# Altium schematic sheet hp_main.SchDoc
size A1
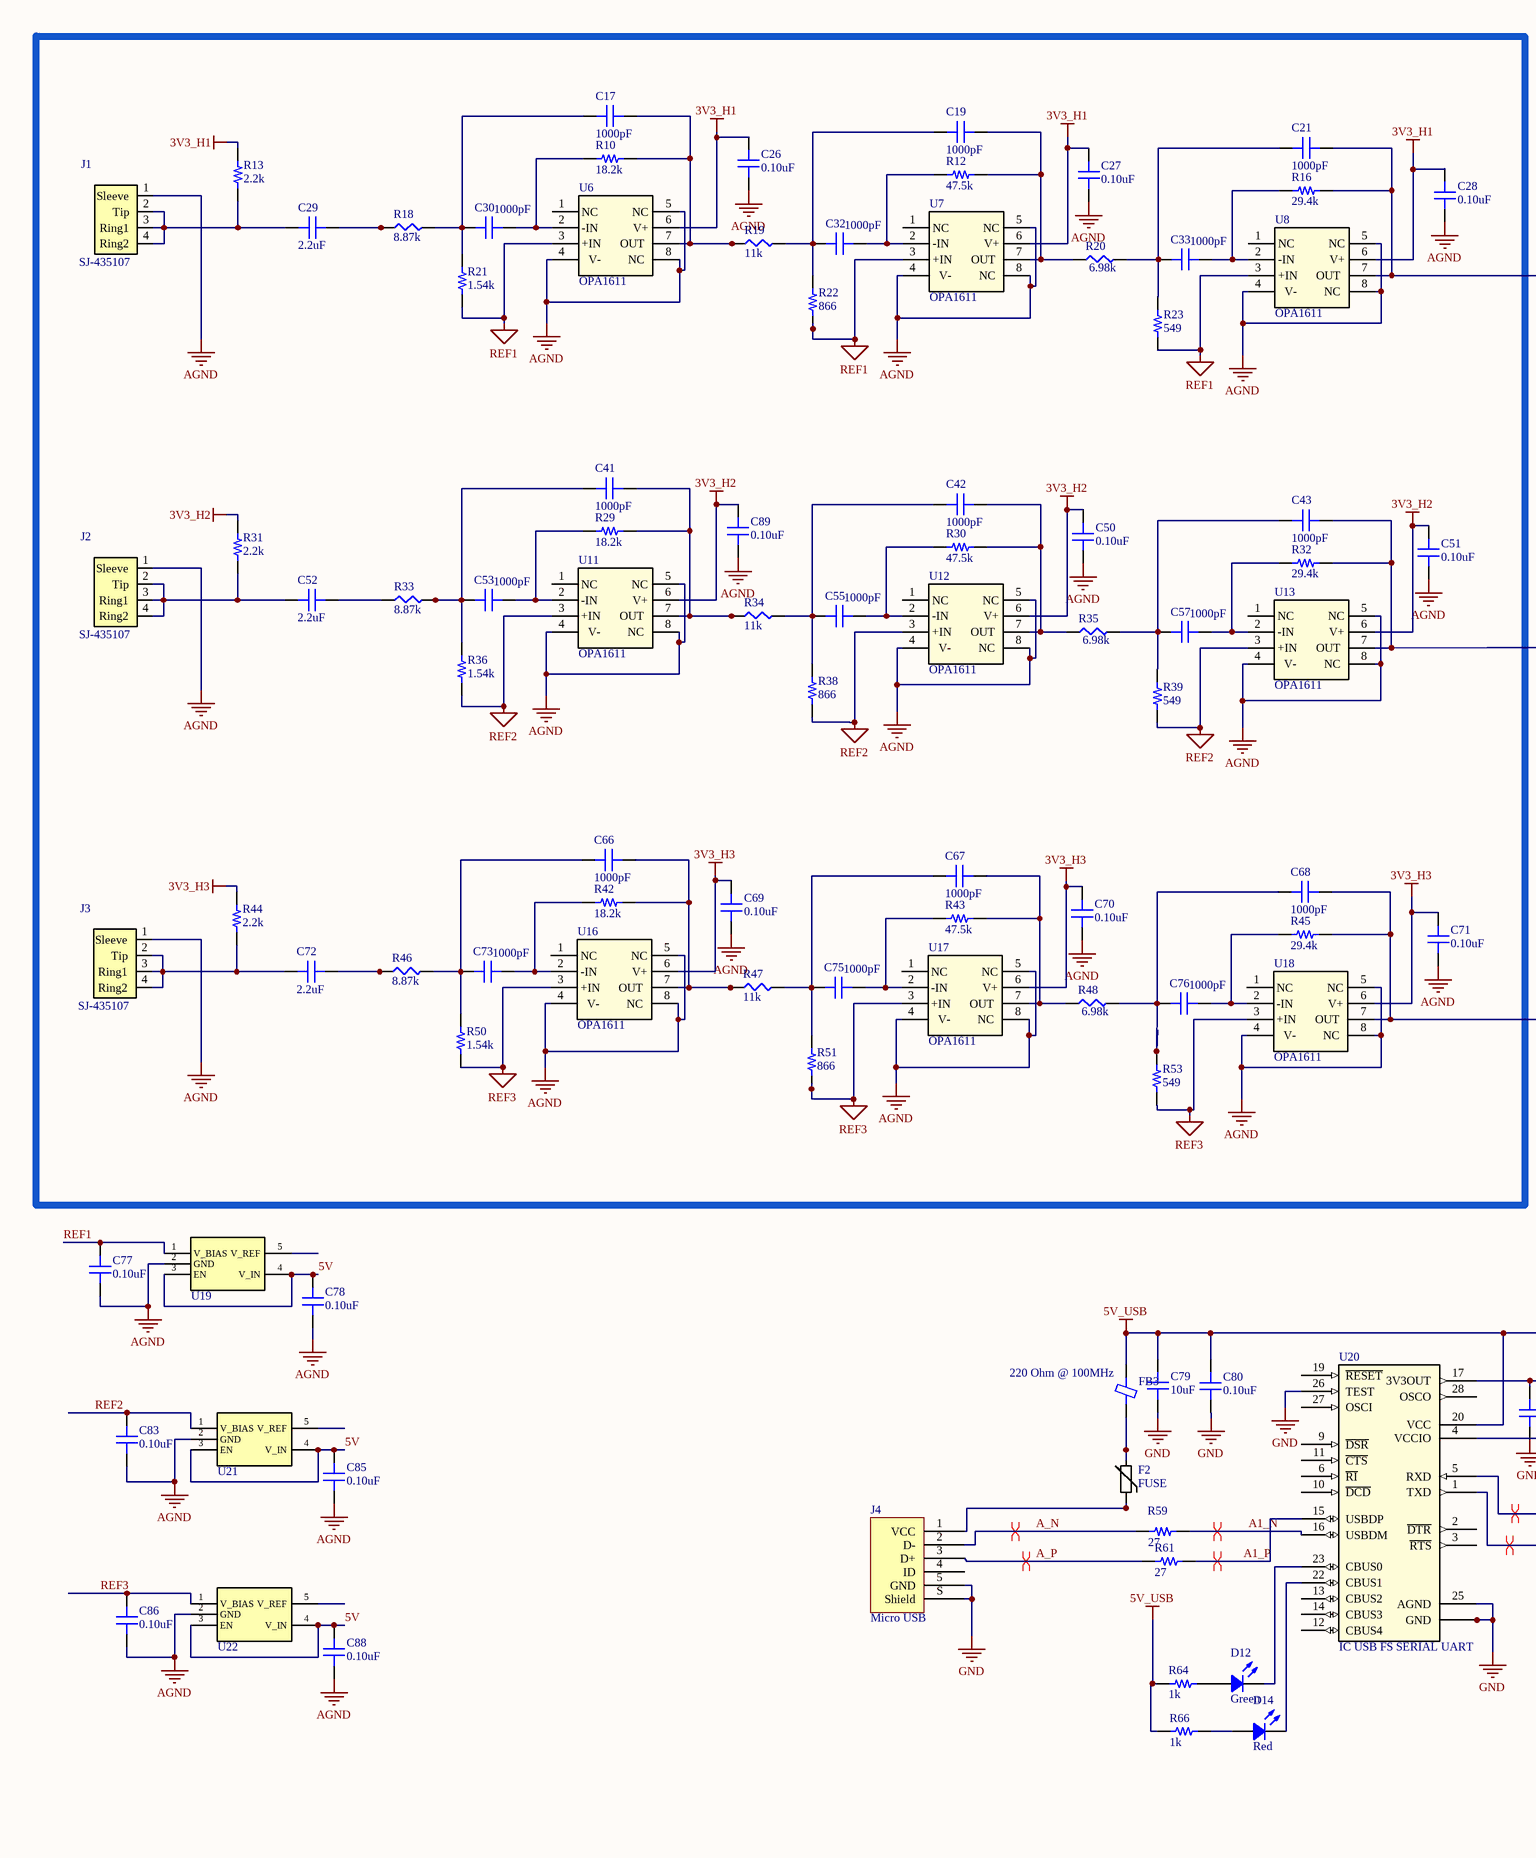
[diagram p0: hp_main.SchDoc, left]
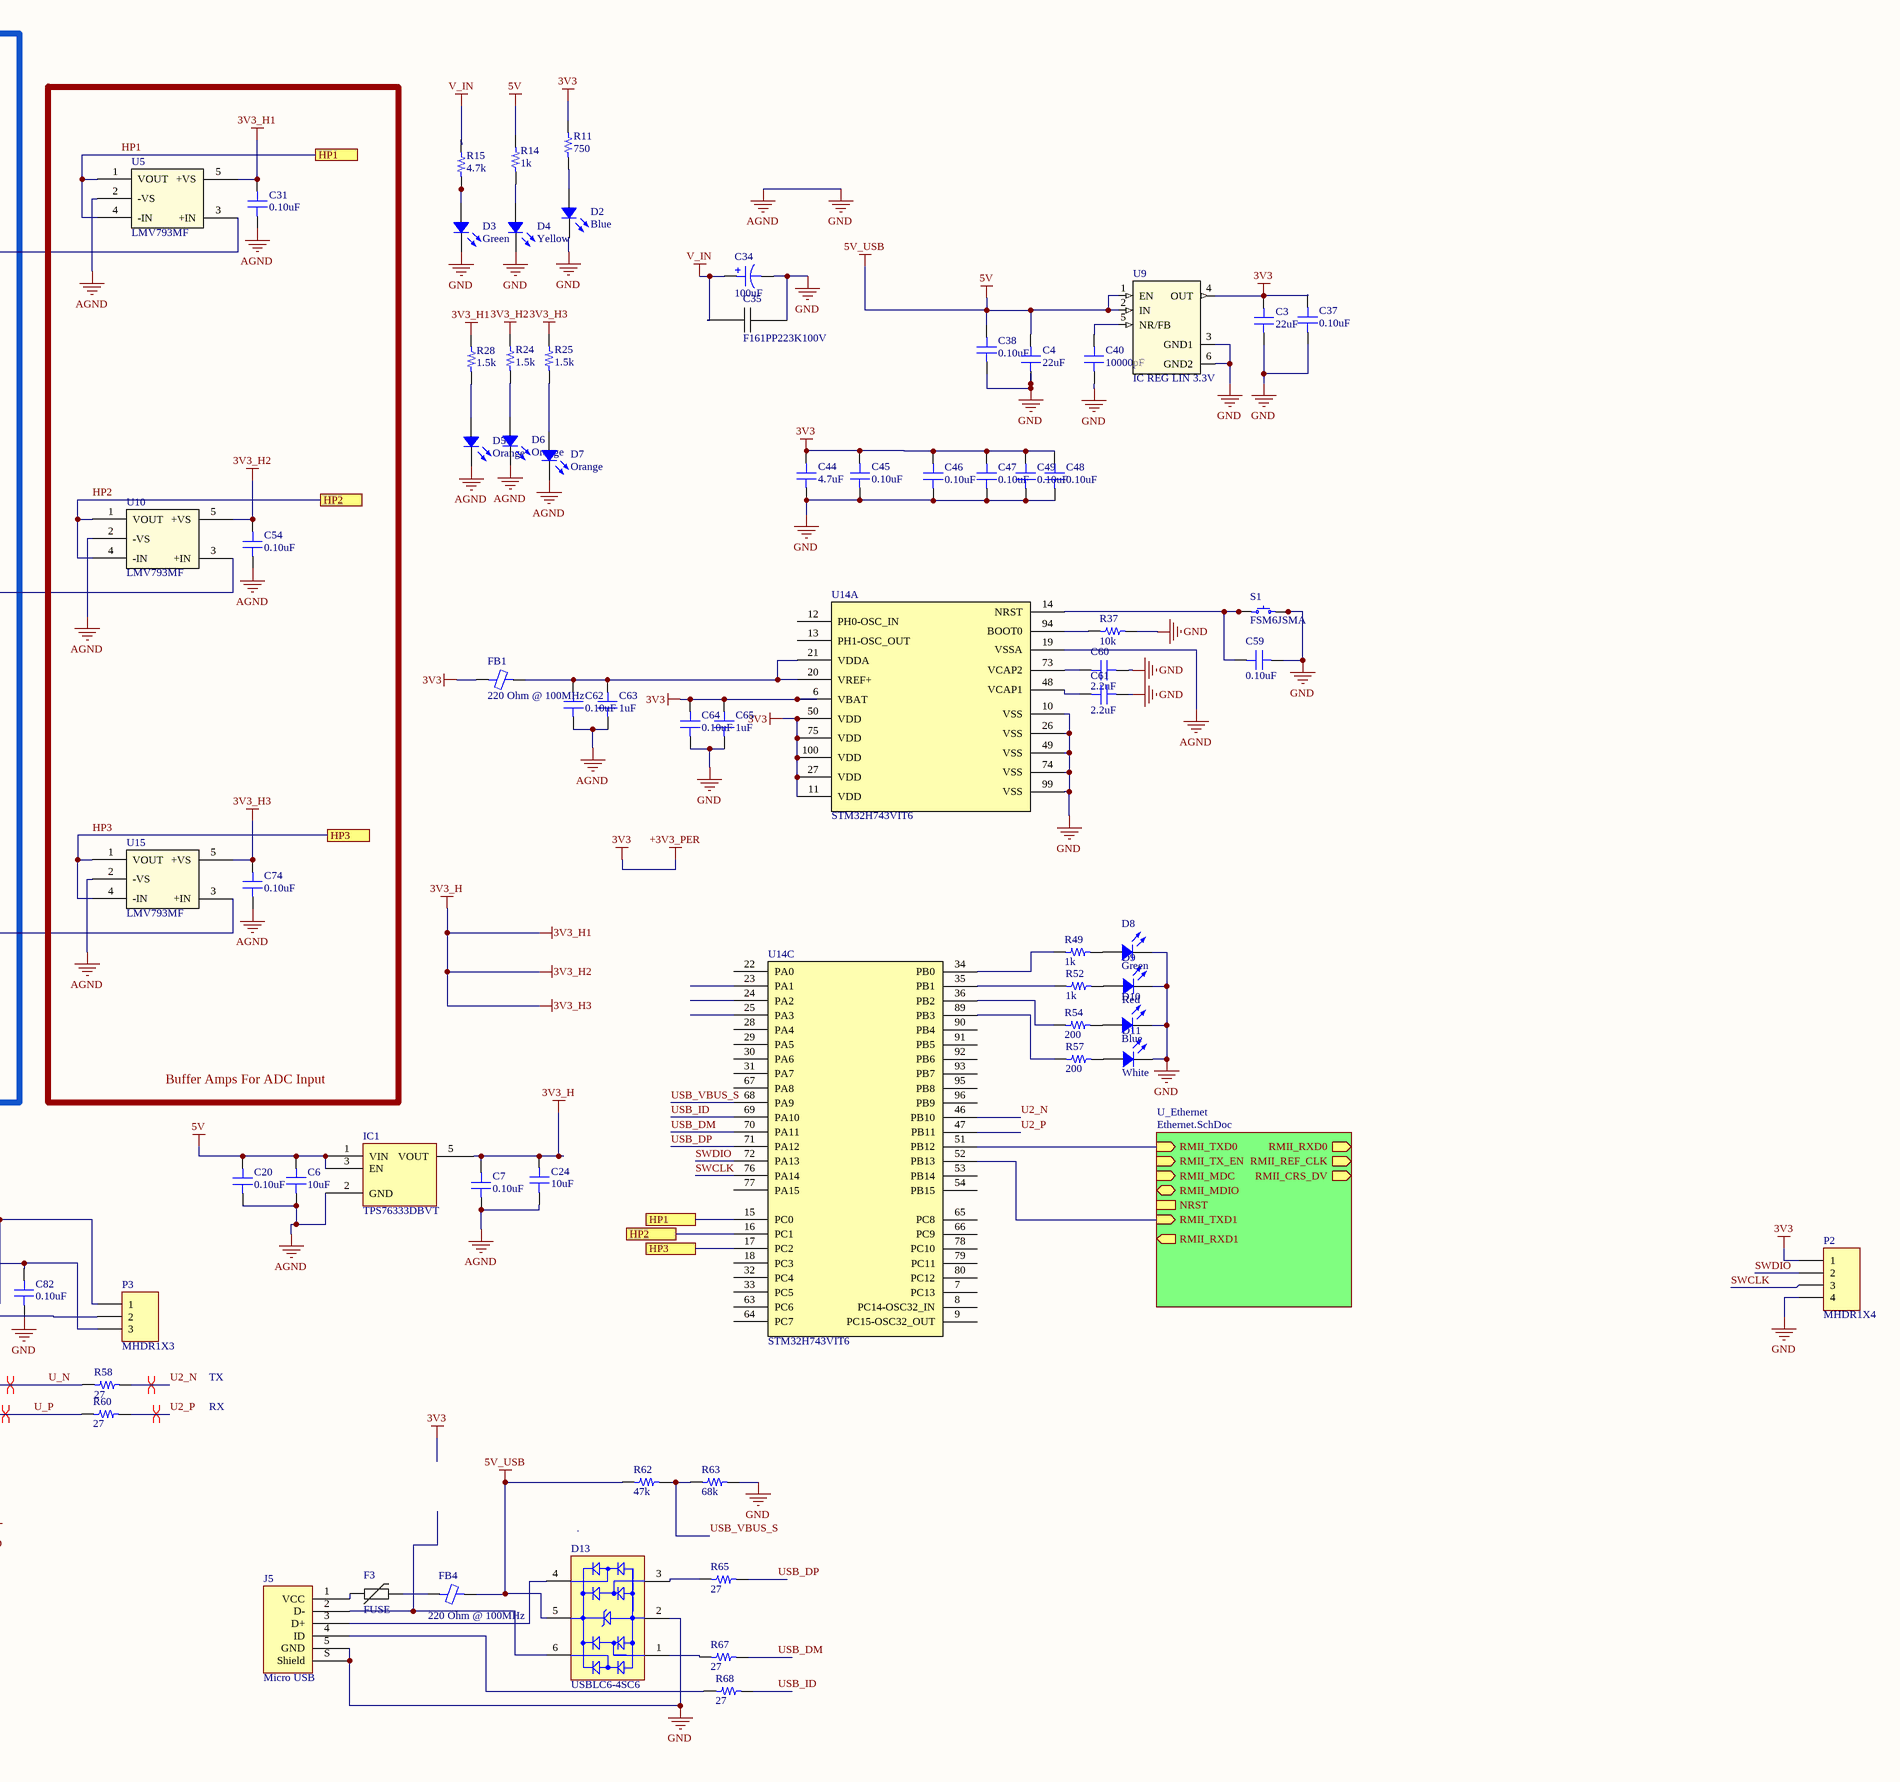
[diagram p1: hp_main.SchDoc, right]

## Parts
C3  22uF  [CAP 1206/3216]
C4  22uF  [CAP 1206/3216]
C6  10uF  [CAP 1206/3216]
C7  0.10uF  [CAP 0805/2012]
C17  1000pF  [CAP 0603/1608]
C19  1000pF  [CAP 0603/1608]
C20  0.10uF  [CAP 0805/2012]
C21  1000pF  [CAP 0603/1608]
C24  10uF  [CAP 1206/3216]
C26  0.10uF  [CAP 0805/2012]
C27  0.10uF  [CAP 0805/2012]
C28  0.10uF  [CAP 0805/2012]
C29  2.2uF  [CAP 0805/2012]
C30  1000pF  [CAP 0603/1608]
C31  0.10uF  [CAP 0805/2012]
C32  1000pF  [CAP 0603/1608]
C33  1000pF  [CAP 0603/1608]
C34  100uF  [CAP ALUM 6.6MM]
C35  F161PP223K100V  [F161PP223K100V]
C37  0.10uF  [CAP 0805/2012]
C38  0.10uF  [CAP 0805/2012]
C40  10000pF  [CAP 0805/2012]
C41  1000pF  [CAP 0603/1608]
C42  1000pF  [CAP 0603/1608]
C43  1000pF  [CAP 0603/1608]
C44  4.7uF  [CAP 0805/2012]
C45  0.10uF  [CAP 0805/2012]
C46  0.10uF  [CAP 0805/2012]
C47  0.10uF  [CAP 0805/2012]
C48  0.10uF  [CAP 0805/2012]
C49  0.10uF  [CAP 0805/2012]
C50  0.10uF  [CAP 0805/2012]
C51  0.10uF  [CAP 0805/2012]
C52  2.2uF  [CAP 0805/2012]
C53  1000pF  [CAP 0603/1608]
C54  0.10uF  [CAP 0805/2012]
C55  1000pF  [CAP 0603/1608]
C57  1000pF  [CAP 0603/1608]
C59  0.10uF  [CAP 0805/2012]
C60  2.2uF  [CAP 0805/2012]
C61  2.2uF  [CAP 0805/2012]
C62  0.10uF  [CAP 0805/2012]
C63  1uF  [CAP 0805/2012]
C64  0.10uF  [CAP 0805/2012]
C65  1uF  [CAP 0805/2012]
C66  1000pF  [CAP 0603/1608]
C67  1000pF  [CAP 0603/1608]
C68  1000pF  [CAP 0603/1608]
C69  0.10uF  [CAP 0805/2012]
C70  0.10uF  [CAP 0805/2012]
C71  0.10uF  [CAP 0805/2012]
C72  2.2uF  [CAP 0805/2012]
C73  1000pF  [CAP 0603/1608]
C74  0.10uF  [CAP 0805/2012]
C75  1000pF  [CAP 0603/1608]
C76  1000pF  [CAP 0603/1608]
C77  0.10uF  [CAP 0805/2012]
C78  0.10uF  [CAP 0805/2012]
C79  10uF  [CAP 1206/3216]
C80  0.10uF  [CAP 0805/2012]
C82  0.10uF  [CAP 0805/2012]
C83  0.10uF  [CAP 0805/2012]
C85  0.10uF  [CAP 0805/2012]
C86  0.10uF  [CAP 0805/2012]
C88  0.10uF  [CAP 0805/2012]
C89  0.10uF  [CAP 0805/2012]
D2  Blue  [LED 0805/2012 BLUE]
D3  Green  [LED 0805/2012 GREEN]
D4  Yellow  [LED 0805/2012 YELLOW]
D5  Orange  [LED 0603/1608 YELLOW]
D6  Orange  [LED 0603/1608 YELLOW]
D7  Orange  [LED 0603/1608 YELLOW]
D8  Green  [LED 0805/2012 GREEN]
D9  Red  [LED 0805/2012 RED]
D10  Blue  [LED 0805/2012 BLUE]
D11  White  [LED 0805/2012]
D12  Green  [LED 0805/2012 GREEN]
D13  USBLC6-4SC6  [STM-SOT23-6L_V]
D14  Red  [LED 0805/2012 RED]
F2  FUSE  [Fuse_0.5A]
F3  FUSE  [Fuse_0.5A]
FB1  220 Ohm @ 100MHz  [FER 0805/2012]
FB3  220 Ohm @ 100MHz  [FER 0805/2012]
FB4  220 Ohm @ 100MHz  [FER 0805/2012]
IC1  TPS76333DBVT  [TI SOT-23-5 DBV]
J1  SJ-435107  [CUI_SJ-435107]
J2  SJ-435107  [CUI_SJ-435107]
J3  SJ-435107  [CUI_SJ-435107]
J4  Micro USB  [FCI USB 10118193-0001LF]
J5  Micro USB  [FCI USB 10118193-0001LF]
P2  MHDR1X4  [MHDR1X4]
P3  MHDR1X3  [MHDR1X3]
R10  18.2k  [RES 0603/1608]
R11  750  [RES 0805/2012]
R12  47.5k  [RES 0603/1608]
R13  2.2k  [RES 1206/3216]
R14  1k  [RES 0805/2012]
R15  4.7k  [RES 0805/2012]
R16  29.4k  [RES 0603/1608]
R18  8.87k  [SMD-0603-RES]
R19  11k  [SMD-0603-RES]
R20  6.98k  [SMD-0603-RES]
R21  1.54k  [RES 0603/1608]
R22  866  [RES 0603/1608]
R23  549  [RES 0603/1608]
R24  1.5k  [RES 0805/2012]
R25  1.5k  [RES 0805/2012]
R28  1.5k  [RES 0805/2012]
R29  18.2k  [RES 0603/1608]
R30  47.5k  [RES 0603/1608]
R31  2.2k  [RES 1206/3216]
R32  29.4k  [RES 0603/1608]
R33  8.87k  [SMD-0603-RES]
R34  11k  [SMD-0603-RES]
R35  6.98k  [SMD-0603-RES]
R36  1.54k  [RES 0603/1608]
R37  10k  [RES 0805/2012]
R38  866  [RES 0603/1608]
R39  549  [RES 0603/1608]
R42  18.2k  [RES 0603/1608]
R43  47.5k  [RES 0603/1608]
R44  2.2k  [RES 1206/3216]
R45  29.4k  [RES 0603/1608]
R46  8.87k  [SMD-0603-RES]
R47  11k  [SMD-0603-RES]
R48  6.98k  [SMD-0603-RES]
R49  1k  [RES 0805/2012]
R50  1.54k  [RES 0603/1608]
R51  866  [RES 0603/1608]
R52  1k  [RES 0805/2012]
R53  549  [RES 0603/1608]
R54  200  [RES 0805/2012]
R57  200  [RES 0805/2012]
R58  27  [RES 0805/2012]
R59  27  [RES 0805/2012]
R60  27  [RES 0805/2012]
R61  27  [RES 0805/2012]
R62  47k  [RES 0805/2012]
R63  68k  [RES 0805/2012]
R64  1k  [RES 0805/2012]
R65  27  [RES 0805/2012]
R66  1k  [RES 0805/2012]
R67  27  [RES 0805/2012]
R68  27  [RES 0805/2012]
S1  FSM6JSMA  [TE FSM6JSMA]
U5  LMV793MF  [SOT23-5]
U6  OPA1611  [OPA1611]
U7  OPA1611  [OPA1611]
U8  OPA1611  [OPA1611]
U9  IC REG LIN 3.3V  [TPS795]
U10  LMV793MF  [SOT23-5]
U11  OPA1611  [OPA1611]
U12  OPA1611  [OPA1611]
U13  OPA1611  [OPA1611]
U14  STM32H743VIT6  [MCU-LQFP100]  (parts A,C of 3)
U15  LMV793MF  [SOT23-5]
U16  OPA1611  [OPA1611]
U17  OPA1611  [OPA1611]
U18  OPA1611  [OPA1611]
U19  REF2033AIDDCR  [SOT23-5]  (value not drawn)
U20  IC USB FS SERIAL UART  [SSOP-28]
U21  REF2033AIDDCR  [SOT23-5]  (value not drawn)
U22  REF2033AIDDCR  [SOT23-5]  (value not drawn)

## Sub-sheets
U_Ethernet = Ethernet.SchDoc: RMII_TXD0 (in), RMII_TX_EN (in), RMII_RXD0 (out), RMII_REF_CLK (out), RMII_CRS_DV (out), RMII_MDC (in), RMII_MDIO (bidir), NRST, RMII_TXD1 (in), RMII_RXD1 (out)

## Ports
HP1, HP2, HP3

## Nets
3V3_H: C7.2 C24.1 C26.2 C27.2 C28.2 C31.2 C50.2 C51.2 C54.2 C69.2 C70.2 C71.2 C74.2 C89.2 IC1.5(VOUT) R13.1 R24.2 R25.2 R28.2 R31.1 R44.1 U5.5(+VS) U6.6(V+) U7.6(V+) U8.6(V+) U10.5(+VS) U11.6(V+) U12.6(V+) U13.6(V+) U15.5(+VS) U16.6(V+) U17.6(V+) U18.6(V+)  [also labelled 3V3_H1, 3V3_H2, 3V3_H3]
5V: C4.2 C6.1 C20.2 C38.2 C78.2 C79.2 C80.2 C85.2 C88.2 D13.5(VBUS) FB3.2 FB4.1 IC1.1(VIN) IC1.3(EN) P3.1 R14.2 R62.1 R64.1 R66.1 U9.1(EN) U9.2(IN) U19.3(EN) U19.4(V_IN) U20.20(VCC) U21.3(EN) U21.4(V_IN) U22.3(EN) U22.4(V_IN)  [also labelled 5V_USB]
+3V3_PER: C3.2 C37.2 C44.2 C45.2 C46.2 C47.2 C48.2 C49.2 C64.2 C65.2 FB1.2 P2.1 R11.1 U9.4(OUT) U14.6(VBAT) U14.11(VDD) U14.27(VDD) U14.50(VDD) U14.75(VDD) U14.100(VDD)  [also labelled 3V3]
AGND: C3.1 C4.1 C6.2 C7.1 C20.1 C24.2 C26.1 C27.1 C28.1 C31.1 C34.2 C35.2 C37.1 C38.1 C40.1 C44.1 C45.1 C46.1 C47.1 C48.1 C49.1 C50.1 C51.1 C54.1 C59.2 C60.2 C61.2 C62.1 C63.1 C64.1 C65.1 C69.1 C70.1 C71.1 C74.1 C77.1 C78.1 C79.1 C80.1 C82.1 C83.1 C85.1 C86.1 C88.1 C89.1 D2.2 D3.2 D4.2 D5.2 D6.2 D7.2 D8.2 D9.2 D10.2 D11.2 D13.2(GND) IC1.2(GND) J1.1(Sleeve) J2.1(Sleeve) J3.1(Sleeve) J4.5(GND) J4.S(Shield) J5.5(GND) J5.S(Shield) P2.4 R37.1 R63.2 S1.3 S1.4 U5.2(-VS) U6.4(V-) U6.5(NC) U6.8(NC) U7.4(V-) U7.5(NC) U7.8(NC) U8.4(V-) U8.5(NC) U8.8(NC) U9.3(GND1) U9.6(GND2) U10.2(-VS) U11.4(V-) U11.5(NC) U11.8(NC) U12.4(V-) U12.5(NC) U12.8(NC) U13.4(V-) U13.5(NC) U13.8(NC) U14.10(VSS) U14.19(VSSA) U14.26(VSS) U14.49(VSS) U14.74(VSS) U14.99(VSS) U15.2(-VS) U16.4(V-) U16.5(NC) U16.8(NC) U17.4(V-) U17.5(NC) U17.8(NC) U18.4(V-) U18.5(NC) U18.8(NC) U19.2(GND) U20.7(GND) U20.18(GND) U20.21(GND) U20.25(AGND) U20.26(TEST) U21.2(GND) U22.2(GND)  [also labelled GND]
REF1: C77.2 R21.1 R22.1 R23.1 U6.3(+IN) U7.3(+IN) U8.3(+IN) U19.1(V_BIAS)
REF2: C83.2 R36.1 R38.1 R39.1 U11.3(+IN) U12.3(+IN) U13.3(+IN) U21.1(V_BIAS)
REF3: C86.2 R50.1 R51.1 R53.1 U16.3(+IN) U17.3(+IN) U18.3(+IN) U22.1(V_BIAS)
V_IN: C34.1 C35.1 R15.2
A1_N: R59.2 U20.16(USBDM)
A1_P: R61.2 U20.15(USBDP)
A_N: J4.2(D-) R59.1
A_P: J4.3(D+) R61.1
HP1: U5.1(VOUT) U5.4(-IN) U14.15(PC0) ; port HP1
HP2: U10.1(VOUT) U10.4(-IN) U14.16(PC1) ; port HP2
HP3: U14.17(PC2) U15.1(VOUT) U15.4(-IN) ; port HP3
SWCLK: P2.3 U14.76(PA14)
SWDIO: P2.2 U14.72(PA13)
U2_N: R58.2 U14.46(PB10)
U2_P: R60.2 U14.47(PB11)
U_N: R58.1 U20.5(RXD)
U_P: R60.1 U20.1(TXD)
USB_DM: R67.2 U14.70(PA11)
USB_DP: R65.2 U14.71(PA12)
USB_ID: R68.2 U14.69(PA10)
USB_VBUS_S: R62.2 R63.1 U14.68(PA9)
NetC17_1: C17.1 C30.1 R18.2 R21.2
NetC17_2: C17.2 R10.2 R19.1 U6.7(OUT)
NetC19_1: C19.1 C32.1 R19.2 R22.2
NetC19_2: C19.2 R12.2 R20.1 U7.7(OUT)
NetC21_1: C21.1 C33.1 R20.2 R23.2
NetC21_2: C21.2 R16.2 U5.3(+IN) U8.7(OUT)
NetC29_1: C29.1 J1.2(Tip) J1.3(Ring1) J1.4(Ring2) R13.2
NetC29_2: C29.2 R18.1
NetC30_2: C30.2 R10.1 U6.2(-IN)
NetC32_2: C32.2 R12.1 U7.2(-IN)
NetC33_2: C33.2 R16.1 U8.2(-IN)
NetC40_2: C40.2 U9.5(NR/FB)
NetC41_1: C41.1 C53.1 R33.2 R36.2
NetC41_2: C41.2 R29.2 R34.1 U11.7(OUT)
NetC42_1: C42.1 C55.1 R34.2 R38.2
NetC42_2: C42.2 R30.2 R35.1 U12.7(OUT)
NetC43_1: C43.1 C57.1 R35.2 R39.2
NetC43_2: C43.2 R32.2 U10.3(+IN) U13.7(OUT)
NetC52_1: C52.1 J2.2(Tip) J2.3(Ring1) J2.4(Ring2) R31.2
NetC52_2: C52.2 R33.1
NetC53_2: C53.2 R29.1 U11.2(-IN)
NetC55_2: C55.2 R30.1 U12.2(-IN)
NetC57_2: C57.2 R32.1 U13.2(-IN)
NetC59_1: C59.1 S1.1 S1.2 U14.14(NRST)
NetC60_1: C60.1 U14.73(VCAP2)
NetC61_1: C61.1 U14.48(VCAP1)
NetC62_2: C62.2 C63.2 FB1.1 U14.20(VREF+) U14.21(VDDA)
NetC66_1: C66.1 C73.1 R46.2 R50.2
NetC66_2: C66.2 R42.2 R47.1 U16.7(OUT)
NetC67_1: C67.1 C75.1 R47.2 R51.2
NetC67_2: C67.2 R43.2 R48.1 U17.7(OUT)
NetC68_1: C68.1 C76.1 R48.2 R53.2
NetC68_2: C68.2 R45.2 U15.3(+IN) U18.7(OUT)
NetC72_1: C72.1 J3.2(Tip) J3.3(Ring1) J3.4(Ring2) R44.2
NetC72_2: C72.2 R46.1
NetC73_2: C73.2 R42.1 U16.2(-IN)
NetC75_2: C75.2 R43.1 U17.2(-IN)
NetC76_2: C76.2 R45.1 U18.2(-IN)
NetC82_2: C82.2 P3.3 U20.17(3V3OUT)
NetD2_1: D2.1 R11.2
NetD3_1: D3.1 R15.1
NetD4_1: D4.1 R14.1
NetD5_1: D5.1 R28.1
NetD6_1: D6.1 R24.1
NetD7_1: D7.1 R25.1
NetD8_1: D8.1 R49.2
NetD9_1: D9.1 R52.2
NetD10_1: D10.1 R54.2
NetD11_1: D11.1 R57.2
NetD12_1: D12.1 R64.2
NetD12_2: D12.2 U20.23(CBUS0)
NetD13_1: D13.1(I/O_1) R67.1
NetD13_3: D13.3(I/O_2) R65.1
NetD13_4: D13.4(I/O_3) J5.3(D+)
NetD13_6: D13.6(I/O_4) J5.2(D-)
NetD14_1: D14.1 R66.2
NetD14_2: D14.2 U20.22(CBUS1)
NetF2_1: F2.1 J4.1(VCC)
NetF2_2: F2.2 FB3.1
NetF3_1: F3.1 FB4.2
NetF3_2: F3.2 J5.1(VCC)
NetJ5_4: J5.4(ID) R68.1
NetP3_2: P3.2 U20.4(VCCIO)
NetR37_2: R37.2 U14.94(BOOT0)
NetR49_1: R49.1 U14.34(PB0)
NetR52_1: R52.1 U14.35(PB1)
NetR54_1: R54.1 U14.36(PB2)
NetR57_1: R57.1 U14.89(PB3)
NetU14_51: U14.51(PB12) ; sheet U_Ethernet/RMII_TXD0
NetU14_52: U14.52(PB13) ; sheet U_Ethernet/RMII_TXD1

Not connected (* = marked no-connect by the designer): J4 4(ID); U6 1(NC); U7 1(NC); U8 1(NC); U11 1(NC); U12 1(NC); U13 1(NC); U14 7(PC13) 8(PC14-OSC32_IN) 9(PC15-OSC32_OUT) 12(PH0-OSC_IN) 13(PH1-OSC_OUT) 18(PC3) 22(PA0) 23(PA1) 24(PA2) 25(PA3) 28(PA4) 29(PA5) 30(PA6) 31(PA7) 32(PC4) 33(PC5) 53(PB14) 54(PB15) 63(PC6) 64(PC7) 65(PC8) 66(PC9) 67(PA8) 77(PA15) 78(PC10) 79(PC11) 80(PC12) 90(PB4) 91(PB5) 92(PB6) 93(PB7) 95(PB8) 96(PB9); U16 1(NC); U17 1(NC); U18 1(NC); U19 5(V_REF); U20 2(~{DTR}) 3(~{RTS}) 6(~{RI}) 9(~{DSR}) 10(~{DCD}) 11(~{CTS}) 12(CBUS4) 13(CBUS2) 14(CBUS3) 19(~{RESET}) 27(OSCI) 28(OSCO); U21 5(V_REF); U22 5(V_REF)

## Layout directives
differential pair: A1_N, A1_P, A_N, A_P, U2_N, U2_P, U_N, U_P

## Notes on the sheet
- Buffer Amps For ADC Input
- TX
- RX

## Library data of the parts
C3 C4 = GRT31CC81C226KE01L: CAP CER 22UF 16V X6S 1206; Manufacturer: Murata Electronics North America; TemperatureRange: -55C ~ 105C; Tolerance: 10%; Value: 22uF; Part Number: GRT31CC81C226KE01L; PartId: 15985; Supplier 1: Digi-Key; Supplier Part Number 1: 490-12409-2-ND; ComponentLink1Description: Datasheet; ComponentLink1URL: http://search.murata.co.jp/Ceramy/image/img/A01X/G101/ENG/GRT31CC81C226KE01-01.pdf; ComponentLink2Description: Digi-Key Listing; ComponentLink2URL: https://www.digikey.com/product-detail/en/murata-electronics-north-america/GRT31CC81C226KE01L/490-12409-2-ND/5416831; TemperatureCoefficient: X6S; Voltage: 16V; Price: 0,1665; Device Package: 1206 (3216 Metric)
C6 C24 C79 = GRT31CR61C106KE01L: CAP CER 10UF 16V X5R 1206; Manufacturer: Murata Electronics North America; TemperatureRange: -55C ~ 85C; Tolerance: 10%; Value: 10uF; Part Number: GRT31CR61C106KE01L; PartId: 16053; Supplier 1: Digi-Key; Supplier Part Number 1: 490-12440-2-ND; ComponentLink1Description: Datasheet; ComponentLink1URL: http://search.murata.co.jp/Ceramy/image/img/A01X/G101/ENG/GRT31CR61C106KE01-01.pdf; ComponentLink2Description: Digi-Key Listing; ComponentLink2URL: https://www.digikey.com/product-detail/en/murata-electronics-north-america/GRT31CR61C106KE01L/490-12440-2-ND/5416862; TemperatureCoefficient: X5R; Voltage: 16V; Price: 0,1361; Device Package: 1206 (3216 Metric)
C7 C20 C26-C28 C31 C37 C38 C50 C51 C54 C59 C69-C71 C74 C77 C78 C83 C85 C86 C88 C89 = CL21B104KCFSFNE: CAP CER 0.1UF 100V X7R 0805; Manufacturer: Samsung Electro-Mechanics America, Inc.; TemperatureRange: -55C ~ 125C; Tolerance: 10%; Value: 0.10uF; Part Number: CL21B104KCFSFNE; PartId: 13753; Supplier 1: Digi-Key; Supplier Part Number 1: 1276-2923-2-ND; ComponentLink1Description: Datasheet; ComponentLink1URL: //media.digikey.com/pdf/Data%20Sheets/Samsung%20PDFs/CL21B104KCFSFNE_Spec.pdf; ComponentLink2Description: Digi-Key Listing; ComponentLink2URL: https://www.digikey.com/product-detail/en/samsung-electro-mechanics-america-inc/CL21B104KCFSFNE/1276-2923-2-ND/3888581; TemperatureCoefficient: X7R; Voltage: 100V; Price: 0,029; Device Package: 0805 (2012 Metric)
C17 C19 C21 C30 C32 C33 C41-C43 C53 C55 C57 C66-C68 C73 C75 C76 = C0603C102F3GACTU: CAP CER 1000PF 25V NP0 0603; Manufacturer: Kemet; TemperatureRange: -55C ~ 125C; TemperatureCoefficient: C0G, NP0; Tolerance: 1%; Value: 1000pF; Part Number: C0603C102F3GACTU; PartId: 13322; Supplier 1: Digi-Key; Supplier Part Number 1: 399-7825-2-ND; ComponentLink1Description: Datasheet; ComponentLink1URL: http://www.kemet.com/docfinder?Partnumber=C0603C102F3GACTU; ComponentLink2Description: Digi-Key Listing; ComponentLink2URL: https://www.digikey.com/product-detail/en/kemet/C0603C102F3GACTU/399-7825-2-ND/2199692; Voltage: 25V; Price: 0,042; Device Package: 0603 (1608 Metric)
C29 C52 C72 = C0805C225K4RACTU: CAP CER 2.2UF 16V X7R 0805; Manufacturer: Kemet; TemperatureRange: -55C ~ 125C; Tolerance: 10%; Value: 2.2uF; Part Number: C0805C225K4RACTU; PartId: 14034; Supplier 1: Digi-Key; Supplier Part Number 1: 399-3523-2-ND; ComponentLink1Description: Datasheet; ComponentLink1URL: http://www.kemet.com/docfinder?Partnumber=C0805C225K4RACTU; ComponentLink2Description: Digi-Key Listing; ComponentLink2URL: https://www.digikey.com/product-detail/en/kemet/C0805C225K4RACTU/399-3523-2-ND/789655; TemperatureCoefficient: X7R; Voltage: 16V; Price: 0,081; Device Package: 0805 (2012 Metric)
C34 = EEE-1EA101XP: CAP ALUM 100UF 20% 25V SMD; Manufacturer: Panasonic Electronic Components; TemperatureRange: -40C ~ 85C; Type: Automotive; Ripple Current: 143mA; Lifetime @ Temp: 2000 Hrs @ 85C; Value: 100uF; Part Number: EEE-1EA101XP; PartId: 7246; Supplier 1: Digi-Key; Supplier Part Number 1: PCE3898TR-ND; ComponentLink1Description: Datasheet; ComponentLink1URL: http://media.digikey.com/pdf/Data%20Sheets/Panasonic%20Electronic%20Components/S_Series_Type_V.pdf; ComponentLink2Description: Digi-Key listing; ComponentLink2URL: http://digikey.com/product-detail/en/EEE-1EA101XP/PCE3898TR-ND/766065; Tolerance: 20%; Voltage: 25V; Price: 0,1724; Device Package: Radial, Can - SMD; Impedance: -
C35 = F161PP223K100V: 0.022µF Film Capacitor 63V 100V Polyester, Polyethylene Terephthalate (PET), Metallized - Stacked 2220 (5750 Metric); Datasheet: https://content.kemet.com/datasheets/KEM_F3086_F161.pdf
C40 = GCJ21BR72E103KXJ3L: CAP CER 10000PF 250V X7R 0805; Manufacturer: Murata Electronics North America; TemperatureRange: -55C ~ 125C; Tolerance: 10%; Value: 10000pF; Part Number: GCJ21BR72E103KXJ3L; PartId: 14337; Supplier 1: Digi-Key; Supplier Part Number 1: 490-5595-2-ND; ComponentLink1Description: Datasheet; ComponentLink1URL: http://www.murata.com/~/media/webrenewal/support/library/catalog/products/capacitor/mlcc/c03e.ashx; ComponentLink2Description: Digi-Key Listing; ComponentLink2URL: https://www.digikey.com/product-detail/en/murata-electronics-north-america/GCJ21BR72E103KXJ3L/490-5595-2-ND/2382023; TemperatureCoefficient: X7R; Voltage: 250V; Price: 0,0541; Device Package: 0805 (2012 Metric)
C44 = GRM219R6YA475KA73D: CAP CER 4.7UF 35V X5R 0805; Manufacturer: Murata Electronics North America; TemperatureRange: -55C ~ 85C; Tolerance: 10%; Value: 4.7uF; Part Number: GRM219R6YA475KA73D; PartId: 13884; Supplier 1: Digi-Key; Supplier Part Number 1: 490-7208-2-ND; ComponentLink1Description: Datasheet; ComponentLink1URL: http://www.murata.com/~/media/webrenewal/support/library/catalog/products/capacitor/mlcc/c02e.pdf; ComponentLink2Description: Digi-Key Listing; ComponentLink2URL: https://www.digikey.com/product-detail/en/murata-electronics-north-america/GRM219R6YA475KA73D/490-7208-2-ND/3900501; TemperatureCoefficient: X5R; Voltage: 35V; Price: 0,0466; Device Package: 0805 (2012 Metric)
C45-C49 C62 C64 C80 C82 = CGA4J2X7R2A104K125AE: CAP CER 0.1UF 100V X7R 0805; Manufacturer: TDK Corporation; TemperatureRange: -55C ~ 125C; Tolerance: 10%; Value: 0.10uF; Part Number: CGA4J2X7R2A104K125AE; PartId: 14278; Supplier 1: Digi-Key; Supplier Part Number 1: 445-15961-2-ND; ComponentLink1Description: Datasheet; ComponentLink1URL: https://product.tdk.com/info/en/catalog/datasheets/mlcc_automotive_soft_en.pdf; ComponentLink2Description: Digi-Key Listing; ComponentLink2URL: https://www.digikey.com/product-detail/en/tdk-corporation/CGA4J2X7R2A104K125AE/445-15961-2-ND/4490598; TemperatureCoefficient: X7R; Voltage: 100V; Price: 0,078; Device Package: 0805 (2012 Metric)
C60 C61 = C2012X7R1H225K125AC: CAP CER 2.2UF 50V X7R 0805; Manufacturer: TDK Corporation; TemperatureRange: -55C ~ 125C; Tolerance: 10%; Value: 2.2uF; Part Number: C2012X7R1H225K125AC; PartId: 4753; Supplier 1: Digi-Key; Supplier Part Number 1: 445-5968-2-ND; ComponentLink1Description: Datasheet; ComponentLink1URL: https://product.tdk.com/info/en/catalog/datasheets/mlcc_commercial_general_en.pdf; ComponentLink2Description: Digi-Key listing; ComponentLink2URL: http://digikey.com/product-detail/en/C2012X7R1H225K125AC/445-5968-2-ND/2443446; TemperatureCoefficient: X7R; Voltage: 50V; Price: 0,1648; Type: -; Device Package: 0805 (2012 Metric)
C63 C65 = GRM216R61E105KA12D: CAP CER 1UF 25V X5R 0805; Manufacturer: Murata Electronics North America; TemperatureRange: -55C ~ 85C; Tolerance: 10%; Value: 1uF; Part Number: GRM216R61E105KA12D; PartId: 13737; Supplier 1: Digi-Key; Supplier Part Number 1: 490-1700-2-ND; ComponentLink1Description: Datasheet; ComponentLink1URL: http://www.murata.com/~/media/webrenewal/support/library/catalog/products/capacitor/mlcc/c02e.pdf; ComponentLink2Description: Digi-Key Listing; ComponentLink2URL: https://www.digikey.com/product-detail/en/murata-electronics-north-america/GRM216R61E105KA12D/490-1700-2-ND/586873; TemperatureCoefficient: X5R; Voltage: 25V; Price: 0,0685; Device Package: 0805 (2012 Metric)
D2 D10 = LTST-C171TBKT: LED BLUE CLEAR 0805 SMD; Manufacturer: Lite-On Inc.; Value: Green; Type: Surface Mount; Millicandela: 104mcd; Voltage Forward: 3.3V; Current (Test): 20mA; Viewing Angle: 130; Part Number: LTST-C171TBKT; PartId: 7084; Supplier 1: Digi-Key; Supplier Part Number 1: 160-1645-2-ND; ComponentLink1Description: Datasheet; ComponentLink1URL: http://optoelectronics.liteon.com/upload/download/DS22-2000-233/S_110_LTST-C171TBKT(0630).pdf; ComponentLink2Description: Digi-Key Listing; ComponentLink2URL: http://www.digikey.ca/product-detail/en/LTST-C171TBKT/160-1645-2-ND/388528; Price: 0,0939; Device Package: 0805 (2012 Metric); Colour: Blue; Lens Transparency: Clear
D3 D8 D12 = LTST-C171KGKT: LED GREEN CLEAR 0805 SMD; Manufacturer: Lite-On Inc.; Type: Surface Mount; Millicandela: 35mcd; Voltage Forward: 2V; Current (Test): 20mA; Viewing Angle: 130; Value: Green; Part Number: LTST-C171KGKT; PartId: 7080; Supplier 1: Digi-Key; Supplier Part Number 1: 160-1426-2-ND; ComponentLink1Description: Datasheet; ComponentLink1URL: http://optoelectronics.liteon.com/upload/download/DS22-2000-118/S_110_LTST-C171KGKT.pdf; ComponentLink2Description: Digi-Key Listing; ComponentLink2URL: http://www.digikey.ca/product-detail/en/LTST-C171KGKT/160-1426-2-ND/386799; Price: 0,0638; Device Package: 0805 (2012 Metric); Colour: Green; Lens Transparency: Clear
D4 = LTST-C171KSKT: LED YELLOW CLEAR 0805 SMD; Manufacturer: Lite-On Inc.; Value: Green; Type: Surface Mount; Millicandela: 50mcd; Voltage Forward: 2V; Current (Test): 20mA; Viewing Angle: 130; Part Number: LTST-C171KSKT; PartId: 7083; Supplier 1: Digi-Key; Supplier Part Number 1: 160-1428-2-ND; ComponentLink1Description: Datasheet; ComponentLink1URL: http://optoelectronics.liteon.com/upload/download/DS22-2000-110/S_110_LTST-C171KSKT.pdf; ComponentLink2Description: Digi-Key Listing; ComponentLink2URL: http://www.digikey.ca/product-detail/en/LTST-C171KSKT/160-1428-2-ND/386803; Price: 0,0679; Device Package: 0805 (2012 Metric); Colour: Yellow; Lens Transparency: Clear
D5-D7 = LO L29K-H2L1-24-Z: LED ORANGE DIFFUSED 0603 SMD; Manufacturer: OSRAM Opto Semiconductors Inc.; Value: Green; Type: Surface Mount; Millicandela: 8.78mcd; Voltage Forward: 1.8V; Current (Test): 2mA; Viewing Angle: 160; Part Number: LO L29K-H2L1-24-Z; PartId: 7061; Supplier 1: Digi-Key; Supplier Part Number 1: 475-2481-2-ND; ComponentLink1Description: Datasheet; ComponentLink1URL: http://www.osram-os.com/Graphics/XPic0/00077105_0.pdf; ComponentLink2Description: Digi-Key Listing; ComponentLink2URL: http://www.digikey.ca/product-detail/en/LO%20L29K-H2L1-24-Z/475-2481-2-ND/1227948; Price: 0,0967; Device Package: 0603 (1608 Metric); Colour: Orange; Lens Transparency: Diffused
D9 D14 = LTST-C171KRKT: LED RED CLEAR 0805 SMD; Manufacturer: Lite-On Inc.; Value: Green; Type: Surface Mount; Millicandela: 54mcd; Voltage Forward: 2V; Current (Test): 20mA; Viewing Angle: 130; Part Number: LTST-C171KRKT; PartId: 7078; Supplier 1: Digi-Key; Supplier Part Number 1: 160-1427-2-ND; ComponentLink1Description: Datasheet; ComponentLink1URL: http://optoelectronics.liteon.com/upload/download/DS22-2000-109/S_110_LTST-C171KRKT.pdf; ComponentLink2Description: Digi-Key Listing; ComponentLink2URL: http://www.digikey.ca/product-detail/en/LTST-C171KRKT/160-1427-2-ND/386801; Price: 0,0638; Device Package: 0805 (2012 Metric); Colour: Red; Lens Transparency: Clear
D11 = LTW-170TK: LED WHITE 0805 SMD; Manufacturer: Lite-On Inc.; Value: Green; Type: Surface Mount; Millicandela: 281mcd; Voltage Forward: 3.3V; Current (Test): 20mA; Viewing Angle: 130; Part Number: LTW-170TK; PartId: 7085; Supplier 1: Digi-Key; Supplier Part Number 1: 160-1738-2-ND; ComponentLink1Description: Datasheet; ComponentLink1URL: http://optoelectronics.liteon.com/upload/download/DS22-2004-078/S_110_LTW-170TK.pdf; ComponentLink2Description: Digi-Key Listing; ComponentLink2URL: http://www.digikey.ca/product-detail/en/LTW-170TK/160-1738-2-ND/758704; Price: 0,1966; Device Package: 0805 (2012 Metric); Colour: White; Lens Transparency: -
D13 = CMP-2000-07370-1: Very Low Capacitance ESD Protection, 3 pF, 4 Protection Lines, -40 to 125 degC, 6-Pin SOT23, RoHS, Tape and Reel; Manufacturer: STMicroelectronics; Product Height (mm): 1.3mm; Rad Hardened: No; Reverse Stand-off Voltage: 5V; Clamping Voltage: 17V; Number of  Elements: 1; Product Depth (mm): 1.75mm; Suppressor Type: DiodeArrays; Direction Type: Uni-Directional; Peak Pulse Current: 5A; Configuration: Quad; Capacitance Value: 4pF; Reverse Breakdown Voltage: 6V; Product Length (mm): 3.05mm; Leakage Current: 0.15uA; Test Current (It): 1mA; Operating Temperature Classification: Automotive; Mounting Style: SurfaceMount; Package Description: 6-Pin Small Outline Transistor, Body 2.925 x 1.625 mm, Pitch 0.95 mm; Mounting Technology: SurfaceMount; Mounting: SurfaceMount; Working Voltage (Max): 5V; Package Reference: SOT23-6L; Package / Case: SOT-23; Operating Temperature Max Deg. C: 125C; Datasheet Version: Rev. 7, 11/2015; Working Voltage: 5V; Pin Count: 6; Leakage Current (Max): 0.15uA; Datasheet URL: http://www.st.com/st-web-ui/static/active/en/resource/technical/document/datasheet/CD00047494.pdf; Polarity: Uni-Directional; Operating Temperature Min Deg. C: -40C; Manufacturer URL: http://www.st.com/; Packaging: TapeandReel; Clamping Voltage (Max): 17V; Operating Temp Range: -40Cto125C
F2 F3 = 0805L050WR: PTC RESET FUSE 6V 500MA 0805; Manufacturer: Littelfuse; Current Rating: 100A; Resistance: 850mR; Power Dissipation: 500mW; Trip Current: 1A; Time to Trip: 0.1s; Approvals: cULus; Supplier 1: Digi-Key; Manufacturer Part Number: 0805L050WR; Stock 1: 55450; Pricing 1: 1 = 0,50000, 5 = 0,48200, 10 = 0,46800, 50 = 0,39360, 100 = 0,32670, 250 = 0,29700, 500 = 0,25246, 1000 = 0,22275 (USD); RoHS: Yes; Case/Package: 0805; Case Code (Metric): 2012; Case Code (Imperial): 0805; Min Operating Temperature: -40°C; Max Operating Temperature: 85°C; Operating Supply Voltage: 6V; Package Quantity: 3000; Packaging: Tape and Reel; Max Current Rating: 100A; Termination: SMD/SMT; Voltage Rating (DC): 6V; Max Voltage Rating (DC): 6V; Working Voltage: 6V; Max Power Dissipation: 500mW; Hold Current: 500mA; Length: 2.2mm; Height: 1.25mm; Width: 1.2mm; REACH SVHC: No SVHC; Lead Free: Lead Free; ComponentLink1URL: https://datasheet.ciiva.com/326/littelfuse-ptc-0805l-326196.pdf?src-supplier=Digi-Key; ComponentLink1Description: https://datasheet.ciiva.com/326/littelfuse-ptc-0805l-326196.pdf?src-supplier=Digi-Key; ComponentLink2URL: https://datasheet.ciiva.com/4501/littelfuse-0805l-32472-4501285.pdf?src-supplier=Mouser; ComponentLink2Description: https://datasheet.ciiva.com/4501/littelfuse-0805l-32472-4501285.pdf?src-supplier=Mouser; ComponentLink3URL: https://datasheet.ciiva.com/326/littelfuse-ptc-0805l-326197.pdf?src-supplier=Digi-Key; ComponentLink3Description: https://datasheet.ciiva.com/326/littelfuse-ptc-0805l-326197.pdf?src-supplier=Digi-Key; ComponentLink4URL: https://datasheet.ciiva.com/326/littelfuse-ptc-0805l-326198.pdf?src-supplier=Digi-Key; ComponentLink4Description: https://datasheet.ciiva.com/326/littelfuse-ptc-0805l-326198.pdf?src-supplier=Digi-Key; ComponentLink5URL: https://datasheet.ciiva.com/16389/littelfuse-0805-16389019.pdf?src-supplier=Future+Electronics; ComponentLink5Description: https://datasheet.ciiva.com/16389/littelfuse-0805-16389019.pdf?src-supplier=Future+Electronics; ComponentLink6URL: https://datasheet.ciiva.com/1273/611626-1273580.pdf?src-supplier=Element14; ComponentLink6Description: https://datasheet.ciiva.com/1273/611626-1273580.pdf?src-supplier=Element14; ComponentLink7URL: https://datasheet.ciiva.com/15186/getdatasheetpartid-27833-15186860.pdf?src-supplier=Verical; ComponentLink7Description: https://datasheet.ciiva.com/15186/getdatasheetpartid-27833-15186860.pdf?src-supplier=Verical; ComponentLink8URL: https://datasheet.ciiva.com/28410/147852-28410764.pdf?src-supplier=Element14; ComponentLink8Description: https://datasheet.ciiva.com/28410/147852-28410764.pdf?src-supplier=Element14; ComponentLink9URL: https://datasheet.ciiva.com/8005/littelfuse-0805-8005343.pdf?src-supplier=Element14; ComponentLink9Description: https://datasheet.ciiva.com/8005/littelfuse-0805-8005343.pdf?src-supplier=Element14
FB1 FB3 FB4 = 742792022: FERRITE CHIP 220 OHM 2.0A 0805; Manufacturer: Wurth Electronics Inc; Type: Differential Mode - Single; DC Resistance: 50 mOhm Max; Current Rating: 2A; Part Number: 742792022; PartId: 6861; Value: 220 Ohm @ 100MHz; Supplier 1: Digi-Key; Supplier Part Number 1: 732-1614-2-ND; ComponentLink1Description: Datasheet; ComponentLink1URL: http://katalog.we-online.de/pbs/datasheet/742792022.pdf; ComponentLink2Description: Digi-Key listing; ComponentLink2URL: http://digikey.com/product-detail/en/742792022/732-1614-2-ND/1639018; Price: 0,2286; Device Package: 0805 (2012 Metric)
IC1 = TPS76333DBVT: IC REG LDO 3.3V 0.15A SOT23-5; Manufacturer: Texas Instruments; Topology: Positive Fixed; Voltage Dropout: 0.3V @ 150mA; Voltage - Input: Up to 10V; Current - Limit (Min): 500mA; Part Number: TPS76333DBVT; PartId: 7953; Supplier 1: Digi-Key; Supplier Part Number 1: 296-2705-2-ND; ComponentLink1Description: Datasheet; ComponentLink1URL: http://www.ti.com/lit/ds/symlink/tps763.pdf; ComponentLink2Description: Digi-Key Listing; ComponentLink2URL: http://www.digikey.ca/product-detail/en/TPS76333DBVT/296-2705-2-ND/306578; Price: 0,8764; Device Package: SC-74A, SOT-753; Voltage - Output: 3.3V; Operating Temperature: -40C ~ 125C
J1-J3 = SJ-435107: 3.50mm (0.141", 1/8", Mini Plug) - Headphone Phone Jack Stereo (4 Conductor, TRRS) Connector Solder; Value: *; ComponentLink1Description: Datasheet; ComponentLink1URL: https://www.cui.com/product/resource/sj-435107.pdf; ComponentLink2Description: Digikey URL; ComponentLink2URL: https://www.digikey.com/product-detail/en/cui-inc/SJ-435107/CP-435107-ND/3064634
J4 J5 = 10118193-0001LF: CONN USB MICRO B RECPT SMT R/A; Manufacturer: FCI; Number Of Positions: 5; Part Number: 10118193-0001LF; PartId: 7864; Supplier 1: Digi-Key; Supplier Part Number 1: 609-4616-2-ND; ComponentLink1Description: Datasheet; ComponentLink1URL: http://portal.fciconnect.com/Comergent//fci/drawing/10118193.pdf; ComponentLink2Description: Digi-Key Listing; ComponentLink2URL: http://www.digikey.ca/product-detail/en/10118193-0001LF/609-4616-2-ND/2785388; Price: 0,2823; Type: USB - micro B; Series: USB 2.0
P2 = MHDR1X4: Header, 4-Pin; LatestRevisionDate: 17-Jul-2002; LatestRevisionNote: Re-released for DXP Platform.; Publisher: Altium Limited
P3 = MHDR1X3: Header, 3-Pin; LatestRevisionDate: 17-Jul-2002; LatestRevisionNote: Re-released for DXP Platform.; Publisher: Altium Limited
R10 R29 R42 = ERA-3AEB1822V: RES SMD 18.2KOHM 0.1% 1/10W 0603; Manufacturer: Panasonic Electronic Components; TemperatureRange: -55C ~ 155C; TemperatureCoefficient: 25ppm/C; PowerRating: 0.1W, 1/10W; Value: 18.2k; Part Number: ERA-3AEB1822V; PartId: 1672; Supplier 1: Digi-Key; Supplier Part Number 1: P18.2KDBTR-ND; ComponentLink1Description: Datasheet; ComponentLink1URL: http://industrial.panasonic.com/lecs/www-data/pdf/AOA0000/AOA0000CE26.pdf; ComponentLink2Description: Digi-Key listing; ComponentLink2URL: http://digikey.com/product-detail/en/ERA-3AEB1822V/P18.2KDBTR-ND/2026860; Tolerance: 0.1%; Price: 0,0653; Type: Thin Film; Device Package: 0603 (1608 Metric)
R11 = ERJ-6ENF7500V: RES SMD 750 OHM 1% 1/8W 0805; Manufacturer: Panasonic Electronic Components; TemperatureRange: -55C ~ 155C; TemperatureCoefficient: 100ppm/C; PowerRating: 0.125W, 1/8W; Value: 750; Part Number: ERJ-6ENF7500V; PartId: 2025; Supplier 1: Digi-Key; Supplier Part Number 1: P750CTR-ND; ComponentLink1Description: Datasheet; ComponentLink1URL: http://industrial.panasonic.com/www-cgi/jvcr13pz.cgi?E+PZ+3+AOA0002+ERJ6ENF7500V+7+WW; ComponentLink2Description: Digi-Key listing; ComponentLink2URL: http://digikey.com/product-detail/en/ERJ-6ENF7500V/P750CTR-ND/111257; Tolerance: 1%; Price: 0,0073; Type: Thick Film; Device Package: 0805 (2012 Metric)
R12 R30 R43 = ERA-3AEB4752V: RES SMD 47.5KOHM 0.1% 1/10W 0603; Manufacturer: Panasonic Electronic Components; TemperatureRange: -55C ~ 155C; TemperatureCoefficient: 25ppm/C; PowerRating: 0.1W, 1/10W; Value: 47.5k; Part Number: ERA-3AEB4752V; PartId: 1771; Supplier 1: Digi-Key; Supplier Part Number 1: P47.5KDBTR-ND; ComponentLink1Description: Datasheet; ComponentLink1URL: http://industrial.panasonic.com/lecs/www-data/pdf/AOA0000/AOA0000CE26.pdf; ComponentLink2Description: Digi-Key listing; ComponentLink2URL: http://digikey.com/product-detail/en/ERA-3AEB4752V/P47.5KDBTR-ND/2026899; Tolerance: 0.1%; Price: 0,0653; Type: Thin Film; Device Package: 0603 (1608 Metric)
R13 R31 R44 = ERJ-8ENF2201V: RES SMD 2.2K OHM 1% 1/4W 1206; Manufacturer: Panasonic Electronic Components; TemperatureRange: -55C ~ 155C; TemperatureCoefficient: 100ppm/C; PowerRating: 0.25W, 1/4W; Value: 2.2k; Part Number: ERJ-8ENF2201V; PartId: 2976; Supplier 1: Digi-Key; Supplier Part Number 1: P2.20KFTR-ND; ComponentLink1Description: Datasheet; ComponentLink1URL: http://industrial.panasonic.com/www-cgi/jvcr13pz.cgi?E+PZ+3+AOA0002+ERJ8ENF2201V+7+WW; ComponentLink2Description: Digi-Key listing; ComponentLink2URL: http://digikey.com/product-detail/en/ERJ-8ENF2201V/P2.20KFTR-ND/1745968; Tolerance: 1%; Price: 0,0093; Type: Thick Film; Device Package: 1206 (3216 Metric)
R14 = ERJ-P06J102V: RES SMD 1K OHM 5% 1/2W 0805; Manufacturer: Panasonic Electronic Components; TemperatureRange: -55C ~ 155C; TemperatureCoefficient: 200ppm/C; PowerRating: 0.5W, 1/2W; Value: 1k; Part Number: ERJ-P06J102V; PartId: 11573; Supplier 1: Digi-Key; Supplier Part Number 1: P1.0KADTR-ND; ComponentLink1Description: Datasheet; ComponentLink1URL: //media.digikey.com/pdf/Data%20Sheets/Panasonic%20Electronic%20Components/ERJ_PA2_P03_PA3_P06_P08_P14.pdf; ComponentLink2Description: Digi-Key Listing; ComponentLink2URL: https://www.digikey.com/product-detail/en/panasonic-electronic-components/ERJ-P06J102V/P1.0KADTR-ND/525197; Tolerance: 5%; Price: 0,0129; Device Package: 0805 (2012 Metric)
R15 = ERJ-6GEYJ472V: RES SMD 4.7K OHM 5% 1/8W 0805; Manufacturer: Panasonic Electronic Components; TemperatureRange: -55C ~ 155C; TemperatureCoefficient: 200ppm/C; PowerRating: 0.125W, 1/8W; Value: 4.7k; Part Number: ERJ-6GEYJ472V; PartId: 11443; Supplier 1: Digi-Key; Supplier Part Number 1: P4.7KATR-ND; ComponentLink1Description: Datasheet; ComponentLink1URL: http://industrial.panasonic.com/www-cgi/jvcr13pz.cgi?E+PZ+3+AOA0001+ERJ6GEYJ472V+7+WW; ComponentLink2Description: Digi-Key Listing; ComponentLink2URL: https://www.digikey.com/product-detail/en/panasonic-electronic-components/ERJ-6GEYJ472V/P4.7KATR-ND/78456; Tolerance: 5%; Price: 0,0032; Device Package: 0805 (2012 Metric)
R16 R32 R45 = ERA-3AEB2942V: RES SMD 29.4KOHM 0.1% 1/10W 0603; Manufacturer: Panasonic Electronic Components; TemperatureRange: -55C ~ 155C; TemperatureCoefficient: 25ppm/C; PowerRating: 0.1W, 1/10W; Value: 29.4k; Part Number: ERA-3AEB2942V; PartId: 1681; Supplier 1: Digi-Key; Supplier Part Number 1: P29.4KDBTR-ND; ComponentLink1Description: Datasheet; ComponentLink1URL: http://industrial.panasonic.com/lecs/www-data/pdf/AOA0000/AOA0000CE26.pdf; ComponentLink2Description: Digi-Key listing; ComponentLink2URL: http://digikey.com/product-detail/en/ERA-3AEB2942V/P29.4KDBTR-ND/2026879; Tolerance: 0.1%; Price: 0,0653; Type: Thin Film; Device Package: 0603 (1608 Metric)
R18 R33 R46 = ERJ-3EKF8871V: RES SMD 8.87K OHM 1% 1/10W 0603; Manufacturer: Panasonic Electronic Components; Factory Stock: 0; Unit Price (USD): 0.00379; @ qty: 1500; Minimum Quantity: 1; Power (Watts): 0.1W, 1/10W; Temperature Coefficient: ±100ppm/°C; Part Number: ERJ-3EKF8871V; Datasheets: http://industrial.panasonic.com/www-cgi/jvcr13pz.cgi?E+PZ+3+AOA0002+ERJ3EKF8871V+7+WW; Image: //media.digikey.com/Photos/Panasonic%20Photos/MFG_ERJ-P6W%20Series.jpg; Digi-Key Part Number: P8.87KHCT-ND; Quantity Available: 62842; Packaging: Cut Tape (CT); Series: ERJ; Part Status: Active; Value: 8.87k; Tolerance: ±1%; Composition: Thick Film; Features: Automotive AEC-Q200; Operating Temperature: -55°C ~ 155°C; Package / Case: 0603 (1608 Metric); Supplier Device Package: 0603; Size / Dimension: 0.063" L x 0.031" W (1.60mm x 0.80mm); Height - Seated (Max): 0.022" (0.55mm); Number of Terminations: 2; Failure Rate: -
R19 R34 R47 = ERJ-3EKF1102V: RES SMD 11K OHM 1% 1/10W 0603; Manufacturer: Panasonic Electronic Components; Factory Stock: 0; Unit Price (USD): 0.00379; @ qty: 1500; Minimum Quantity: 1; Power (Watts): 0.1W, 1/10W; Temperature Coefficient: ±100ppm/°C; Part Number: ERJ-3EKF1102V; Datasheets: http://industrial.panasonic.com/www-cgi/jvcr13pz.cgi?E+PZ+3+AOA0002+ERJ3EKF1102V+7+WW; Image: //media.digikey.com/Photos/Panasonic%20Photos/MFG_ERJ-P6W%20Series.jpg; Digi-Key Part Number: P11.0KHCT-ND; Quantity Available: 6648; Packaging: Cut Tape (CT); Series: ERJ; Part Status: Active; Value: 11k; Tolerance: ±1%; Composition: Thick Film; Features: Automotive AEC-Q200; Operating Temperature: -55°C ~ 155°C; Package / Case: 0603 (1608 Metric); Supplier Device Package: 0603; Size / Dimension: 0.063" L x 0.031" W (1.60mm x 0.80mm); Height - Seated (Max): 0.022" (0.55mm); Number of Terminations: 2; Failure Rate: -
R20 R35 R48 = ERJ-3EKF6981V: RES SMD 6.98K OHM 1% 1/10W 0603; Manufacturer: Panasonic Electronic Components; Factory Stock: 0; Unit Price (USD): 0.00379; @ qty: 1500; Minimum Quantity: 1; Power (Watts): 0.1W, 1/10W; Temperature Coefficient: ±100ppm/°C; Part Number: ERJ-3EKF6981V; Datasheets: http://industrial.panasonic.com/www-cgi/jvcr13pz.cgi?E+PZ+3+AOA0002+ERJ3EKF6981V+7+WW; Image: //media.digikey.com/Photos/Panasonic%20Photos/MFG_ERJ-P6W%20Series.jpg; Digi-Key Part Number: P6.98KHCT-ND; Quantity Available: 29823; Packaging: Cut Tape (CT); Series: ERJ; Part Status: Active; Value: 6.98k; Tolerance: ±1%; Composition: Thick Film; Features: Automotive AEC-Q200; Operating Temperature: -55°C ~ 155°C; Package / Case: 0603 (1608 Metric); Supplier Device Package: 0603; Size / Dimension: 0.063" L x 0.031" W (1.60mm x 0.80mm); Height - Seated (Max): 0.022" (0.55mm); Number of Terminations: 2; Failure Rate: -
R21 R36 R50 = ERJ-3EKF1541V: RES SMD 1.54K OHM 1% 1/10W 0603; Manufacturer: Panasonic Electronic Components; TemperatureRange: -55C ~ 155C; TemperatureCoefficient: 100ppm/C; PowerRating: 0.1W, 1/10W; Value: 1.54k; Part Number: ERJ-3EKF1541V; PartId: 1145; Supplier 1: Digi-Key; Supplier Part Number 1: P1.54KHTR-ND; ComponentLink1Description: Datasheet; ComponentLink1URL: http://industrial.panasonic.com/www-cgi/jvcr13pz.cgi?E+PZ+3+AOA0002+ERJ3EKF1541V+7+WW; ComponentLink2Description: Digi-Key listing; ComponentLink2URL: http://digikey.com/product-detail/en/ERJ-3EKF1541V/P1.54KHTR-ND/196053; Tolerance: 1%; Price: 0,0038; Type: Thick Film; Device Package: 0603 (1608 Metric)
R22 R38 R51 = ERA-3AEB8660V: RES SMD 866 OHM 0.1% 1/10W 0603; Manufacturer: Panasonic Electronic Components; TemperatureRange: -55C ~ 155C; TemperatureCoefficient: 25ppm/C; PowerRating: 0.1W, 1/10W; Value: 866; Part Number: ERA-3AEB8660V; PartId: 1652; Supplier 1: Digi-Key; Supplier Part Number 1: P866DBTR-ND; ComponentLink1Description: Datasheet; ComponentLink1URL: http://industrial.panasonic.com/lecs/www-data/pdf/AOA0000/AOA0000CE26.pdf; ComponentLink2Description: Digi-Key listing; ComponentLink2URL: http://digikey.com/product-detail/en/ERA-3AEB8660V/P866DBTR-ND/2026743; Tolerance: 0.1%; Price: 0,0653; Type: Thin Film; Device Package: 0603 (1608 Metric)
R23 R39 R53 = ERA-3AED5490V: RES SMD 549 OHM 0.5% 1/10W 0603; Manufacturer: Panasonic Electronic Components; TemperatureRange: -55C ~ 155C; TemperatureCoefficient: 25ppm/C; PowerRating: 0.1W, 1/10W; Value: 549; Part Number: ERA-3AED5490V; PartId: 1938; Supplier 1: Digi-Key; Supplier Part Number 1: P549BLTR-ND; ComponentLink1Description: Datasheet; ComponentLink1URL: http://industrial.panasonic.com/lecs/www-data/pdf/AOA0000/AOA0000CE26.pdf; ComponentLink2Description: Digi-Key listing; ComponentLink2URL: http://digikey.com/product-detail/en/ERA-3AED5490V/P549BLTR-ND/3481345; Tolerance: 0.5%; Price: 0,0238; Type: Thin Film; Device Package: 0603 (1608 Metric)
R24 R25 R28 = ERJ-6GEYJ152V: RES SMD 1.5K OHM 5% 1/8W 0805; Manufacturer: Panasonic Electronic Components; TemperatureRange: -55C ~ 155C; TemperatureCoefficient: 200ppm/C; PowerRating: 0.125W, 1/8W; Value: 1.5k; Part Number: ERJ-6GEYJ152V; PartId: 11512; Supplier 1: Digi-Key; Supplier Part Number 1: P1.5KATR-ND; ComponentLink1Description: Datasheet; ComponentLink1URL: http://industrial.panasonic.com/www-cgi/jvcr13pz.cgi?E+PZ+3+AOA0001+ERJ6GEYJ152V+7+WW; ComponentLink2Description: Digi-Key Listing; ComponentLink2URL: https://www.digikey.com/product-detail/en/panasonic-electronic-components/ERJ-6GEYJ152V/P1.5KATR-ND/83022; Tolerance: 5%; Price: 0,0032; Device Package: 0805 (2012 Metric)
R37 = ERJ-6ENF1002V: RES SMD 10K OHM 1% 1/8W 0805; Manufacturer: Panasonic Electronic Components; TemperatureRange: -55C ~ 155C; TemperatureCoefficient: 100ppm/C; PowerRating: 0.125W, 1/8W; Value: 10k; Part Number: ERJ-6ENF1002V; PartId: 1947; Supplier 1: Digi-Key; Supplier Part Number 1: P10.0KCTR-ND; ComponentLink1Description: Datasheet; ComponentLink1URL: http://industrial.panasonic.com/www-cgi/jvcr13pz.cgi?E+PZ+3+AOA0002+ERJ6ENF1002V+7+WW; ComponentLink2Description: Digi-Key listing; ComponentLink2URL: http://digikey.com/product-detail/en/ERJ-6ENF1002V/P10.0KCTR-ND/111474; Tolerance: 1%; Price: 0,0073; Type: Thick Film; Device Package: 0805 (2012 Metric)
R49 R52 R64 R66 = ERJ-6ENF1001V: RES SMD 1K OHM 1% 1/8W 0805; Manufacturer: Panasonic Electronic Components; TemperatureRange: -55C ~ 155C; TemperatureCoefficient: 100ppm/C; PowerRating: 0.125W, 1/8W; Value: 1k; Part Number: ERJ-6ENF1001V; PartId: 1948; Supplier 1: Digi-Key; Supplier Part Number 1: P1.00KCTR-ND; ComponentLink1Description: Datasheet; ComponentLink1URL: http://industrial.panasonic.com/www-cgi/jvcr13pz.cgi?E+PZ+3+AOA0002+ERJ6ENF1001V+7+WW; ComponentLink2Description: Digi-Key listing; ComponentLink2URL: http://digikey.com/product-detail/en/ERJ-6ENF1001V/P1.00KCTR-ND/111281; Tolerance: 1%; Price: 0,0073; Type: Thick Film; Device Package: 0805 (2012 Metric)
R54 R57 = ERJ-6ENF2000V: RES SMD 200 OHM 1% 1/8W 0805; Manufacturer: Panasonic Electronic Components; TemperatureRange: -55C ~ 155C; TemperatureCoefficient: 100ppm/C; PowerRating: 0.125W, 1/8W; Value: 200; Part Number: ERJ-6ENF2000V; PartId: 1985; Supplier 1: Digi-Key; Supplier Part Number 1: P200CTR-ND; ComponentLink1Description: Datasheet; ComponentLink1URL: http://industrial.panasonic.com/www-cgi/jvcr13pz.cgi?E+PZ+3+AOA0002+ERJ6ENF2000V+7+WW; ComponentLink2Description: Digi-Key listing; ComponentLink2URL: http://digikey.com/product-detail/en/ERJ-6ENF2000V/P200CTR-ND/111147; Tolerance: 1%; Price: 0,0073; Type: Thick Film; Device Package: 0805 (2012 Metric)
R58-R61 R65 R67 R68 = ERJ-6ENF27R0V: RES SMD 27 OHM 1% 1/8W 0805; Manufacturer: Panasonic Electronic Components; TemperatureRange: -55C ~ 155C; TemperatureCoefficient: 100ppm/C; PowerRating: 0.125W, 1/8W; Value: 27; Part Number: ERJ-6ENF27R0V; PartId: 2142; Supplier 1: Digi-Key; Supplier Part Number 1: P27.0CTR-ND; ComponentLink1Description: Datasheet; ComponentLink1URL: http://industrial.panasonic.com/www-cgi/jvcr13pz.cgi?E+PZ+3+AOA0002+ERJ6ENF27R0V+7+WW; ComponentLink2Description: Digi-Key listing; ComponentLink2URL: http://digikey.com/product-detail/en/ERJ-6ENF27R0V/P27.0CTR-ND/1746483; Tolerance: 1%; Price: 0,0073; Type: Thick Film; Device Package: 0805 (2012 Metric)
R62 = ERJ-6GEYJ473V: RES SMD 47K OHM 5% 1/8W 0805; Manufacturer: Panasonic Electronic Components; TemperatureRange: -55C ~ 155C; TemperatureCoefficient: 200ppm/C; PowerRating: 0.125W, 1/8W; Value: 47k; Part Number: ERJ-6GEYJ473V; PartId: 11446; Supplier 1: Digi-Key; Supplier Part Number 1: P47KATR-ND; ComponentLink1Description: Datasheet; ComponentLink1URL: http://industrial.panasonic.com/www-cgi/jvcr13pz.cgi?E+PZ+3+AOA0001+ERJ6GEYJ473V+7+WW; ComponentLink2Description: Digi-Key Listing; ComponentLink2URL: https://www.digikey.com/product-detail/en/panasonic-electronic-components/ERJ-6GEYJ473V/P47KATR-ND/83094; Tolerance: 5%; Price: 0,0032; Device Package: 0805 (2012 Metric)
R63 = ERJ-6ENF6802V: RES SMD 68K OHM 1% 1/8W 0805; Manufacturer: Panasonic Electronic Components; TemperatureRange: -55C ~ 155C; TemperatureCoefficient: 100ppm/C; PowerRating: 0.125W, 1/8W; Value: 68k; Part Number: ERJ-6ENF6802V; PartId: 2068; Supplier 1: Digi-Key; Supplier Part Number 1: P68.0KCTR-ND; ComponentLink1Description: Datasheet; ComponentLink1URL: http://industrial.panasonic.com/www-cgi/jvcr13pz.cgi?E+PZ+3+AOA0002+ERJ6ENF6802V+7+WW; ComponentLink2Description: Digi-Key listing; ComponentLink2URL: http://digikey.com/product-detail/en/ERJ-6ENF6802V/P68.0KCTR-ND/1746528; Tolerance: 1%; Price: 0,0073; Type: Thick Film; Device Package: 0805 (2012 Metric)
S1 = FSM6JSMA: SWITCH TACTILE SPST-NO 0.05A 24V; Manufacturer: TE Connectivity Alcoswitch Switches; Switch Function: Off-Mom; Contact Rating @ Voltage: 0.05A @ 24VDC; Actuator Type: Standard; Actuator Orientation: Top Actuated; Illumination: Non-Illuminated; Operating Force: 160gf; Switch Travel: 0.25mm; Mechanical Life: 100,000 Cycles; Part Number: FSM6JSMA; PartId: 7910; Supplier 1: Digi-Key; Supplier Part Number 1: 450-1133-ND; ComponentLink1Description: Datasheet; ComponentLink1URL: http://www.te.com/commerce/DocumentDelivery/DDEController?Action=srchrtrv&DocNm=2-1437565-7&DocType=Customer+Drawing&DocLang=English; ComponentLink2Description: Digi-Key Listing; ComponentLink2URL: http://www.digikey.com/product-detail/en/FSM6JSMA/450-1133-ND/525822; Price: 0,24; Circuit: SPST-NO; Illumination Voltage: -; Illumination Type, Colour: -; Operating Temperature: -35C ~ 85C
U5 U10 U15 = LMV793MF: General Purpose Amplifier 1 Circuit Rail-to-Rail SOT-23-5; Digikey Link: https://www.digikey.com/product-detail/en/texas-instruments/LMV793MF-NOPB/LMV793MF-NOPBCT-ND/1658221
U6-U8 U11-U13 U16-U18 = OPA1611: IC OPAMP AUDIO 80MHZ 8SOIC; ComponentLink1Description: Digikey URL; ComponentLink1URL: https://www.digikey.com/product-detail/en/texas-instruments/OPA1611AID/296-24958-5-ND/2126268; ComponentLink2Description: Datasheet; ComponentLink2URL: http://www.ti.com/lit/ds/symlink/opa1611.pdf
U9 = TPS795: Linear Voltage Regulator IC Positive Fixed 1 Output 500mA SOT-223-6
U14 = STM32H743VIT6: ARM® Cortex®-M7 STM32H7 Microcontroller IC 32-Bit 400MHz 2MB (2M x 8) FLASH 100-LQFP (14x14); Digikey Link: https://www.digikey.com/product-detail/en/stmicroelectronics/STM32H743VIT6/497-17720-ND/7809237
U19 U21 U22 = REF2033AIDDCR: Series Voltage Reference IC ±0.05% 20mA SOT-23-5; Digikey Link: https://www.digikey.com/product-detail/en/texas-instruments/REF2033AIDDCR/296-46177-1-ND/7033352
U20 = FT232RL: USB Bridge, USB to UART USB 2.0 UART Interface 28-SSOP; ComponentLink1Description: Digikey Link; ComponentLink1URL: https://www.digikey.com/product-detail/en/ftdi-future-technology-devices-international-ltd/FT232RL-REEL/768-1007-1-ND/1836402